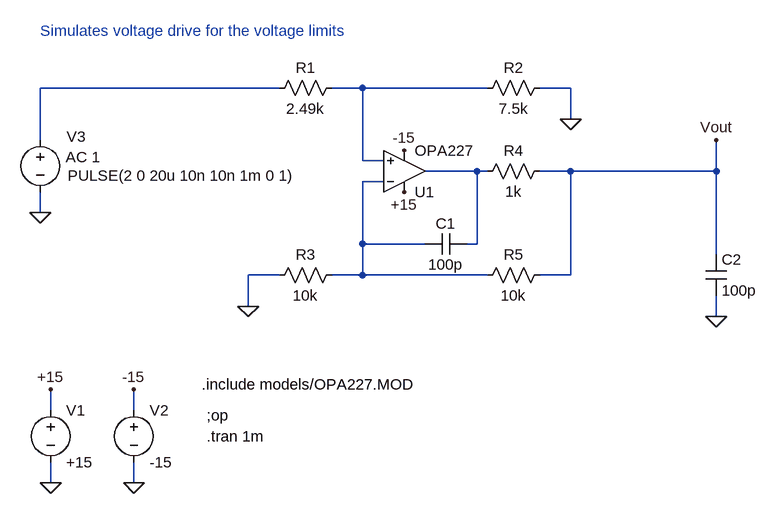
[diagram p0: schematic limit_driver.asc]
limit_driver.asc, the LTspice schematic file:
Version 4
SHEET 1 880 680
WIRE -336 -272 -704 -272
WIRE -208 -272 -256 -272
WIRE -16 -272 -208 -272
WIRE 112 -272 64 -272
WIRE 112 -224 112 -272
WIRE -704 -192 -704 -272
WIRE -208 -160 -208 -272
WIRE -176 -160 -208 -160
WIRE -32 -144 -112 -144
WIRE -16 -144 -32 -144
WIRE 112 -144 64 -144
WIRE 336 -144 336 -192
WIRE 336 -144 112 -144
WIRE -176 -128 -208 -128
WIRE -704 -80 -704 -112
WIRE -208 -32 -208 -128
WIRE -112 -32 -208 -32
WIRE -32 -32 -32 -144
WIRE -32 -32 -48 -32
WIRE 336 -16 336 -144
WIRE -336 16 -384 16
WIRE -208 16 -208 -32
WIRE -208 16 -256 16
WIRE -16 16 -208 16
WIRE 112 16 112 -144
WIRE 112 16 64 16
WIRE -384 64 -384 16
WIRE 336 80 336 48
WIRE -688 224 -688 192
WIRE -560 224 -560 192
WIRE -688 336 -688 304
WIRE -560 336 -560 304
FLAG -688 336 0
FLAG -560 336 0
FLAG -688 192 +15
FLAG -560 192 -15
FLAG -144 -112 +15
FLAG -144 -176 -15
FLAG -704 -80 0
FLAG 336 -192 Vout
FLAG 112 -224 0
FLAG -384 64 0
FLAG 336 80 0
SYMBOL voltage -688 208 R0
WINDOW 123 0 0 Left 0
WINDOW 39 0 0 Left 0
SYMATTR InstName V1
SYMATTR Value +15
SYMBOL voltage -560 208 R0
WINDOW 123 0 0 Left 0
WINDOW 39 0 0 Left 0
SYMATTR InstName V2
SYMATTR Value -15
SYMBOL Opamps\\opamp2 -144 -80 M180
SYMATTR InstName U1
SYMATTR Value OPA227
SYMBOL voltage -704 -208 R0
WINDOW 0 41 11 Left 0
WINDOW 3 42 71 Left 0
WINDOW 123 39 42 Left 0
WINDOW 39 0 0 Left 0
SYMATTR InstName V3
SYMATTR Value PULSE(2 0 20u 10n 10n 1m 0 1)
SYMATTR Value2 AC 1
SYMBOL res -352 -256 R270
WINDOW 0 32 56 VTop 0
WINDOW 3 0 56 VBottom 0
SYMATTR InstName R1
SYMATTR Value 2.49k
SYMBOL res -32 -256 R270
WINDOW 0 32 56 VTop 0
WINDOW 3 0 56 VBottom 0
SYMATTR InstName R2
SYMATTR Value 7.5k
SYMBOL res -352 32 R270
WINDOW 0 32 56 VTop 0
WINDOW 3 0 56 VBottom 0
SYMATTR InstName R3
SYMATTR Value 10k
SYMBOL res -32 -128 R270
WINDOW 0 32 56 VTop 0
WINDOW 3 0 56 VBottom 0
SYMATTR InstName R4
SYMATTR Value 1k
SYMBOL res -32 32 R270
WINDOW 0 32 56 VTop 0
WINDOW 3 0 56 VBottom 0
SYMATTR InstName R5
SYMATTR Value 10k
SYMBOL cap -112 -16 R270
WINDOW 0 32 32 VTop 0
WINDOW 3 0 32 VBottom 0
SYMATTR InstName C1
SYMATTR Value 100p
SYMBOL cap 320 -16 R0
SYMATTR InstName C2
SYMATTR Value 100p
TEXT -456 184 Left 0 !.include models/OPA227.MOD
TEXT -448 232 Left 0 !;op
TEXT -448 264 Left 0 !.tran 1m
TEXT -704 -360 Left 0 ;Simulates voltage drive for the voltage limits

The netlist it stands for:
* limit_driver.asc
V1 +15 0 +15
V2 -15 0 -15
XU1 N002 N004 +15 -15 N003 OPA227  ; pins In+ In- V+ V- OUT
V3 N001 0 PULSE(2 0 20u 10n 10n 1m 0 1) AC 1
R1 N001 N002 2.49k
R2 N002 0 7.5k
R3 0 N004 10k
R4 N003 Vout 1k
R5 N004 Vout 10k
C1 N004 N003 100p
C2 Vout 0 100p
.include models/OPA227.MOD
;op
.tran 1m
* Simulates voltage drive for the voltage limits
.backanno
.end